# Altium schematic sheet PWR_stage_AC.SchDoc
size 420 x 297 mm; SPICEModelCacheMYOJSQKR: <root> / <DocumentId>MYOJSQKR</DocumentId> / <CacheFrame Number="0"> / <Model Name="860080473007_120uf" Kind="CKT"> / <Text>******* / .subckt 860080473007_120uF 1 2 / Rser 1 3 0.1 / Lser 2 4 0.000000005 / C1 3 4 0.00012 / Rpar 3 4 833333.333333333 / .ends 860080473007_120uF</Text> / </Model> / </CacheFrame> / </root>
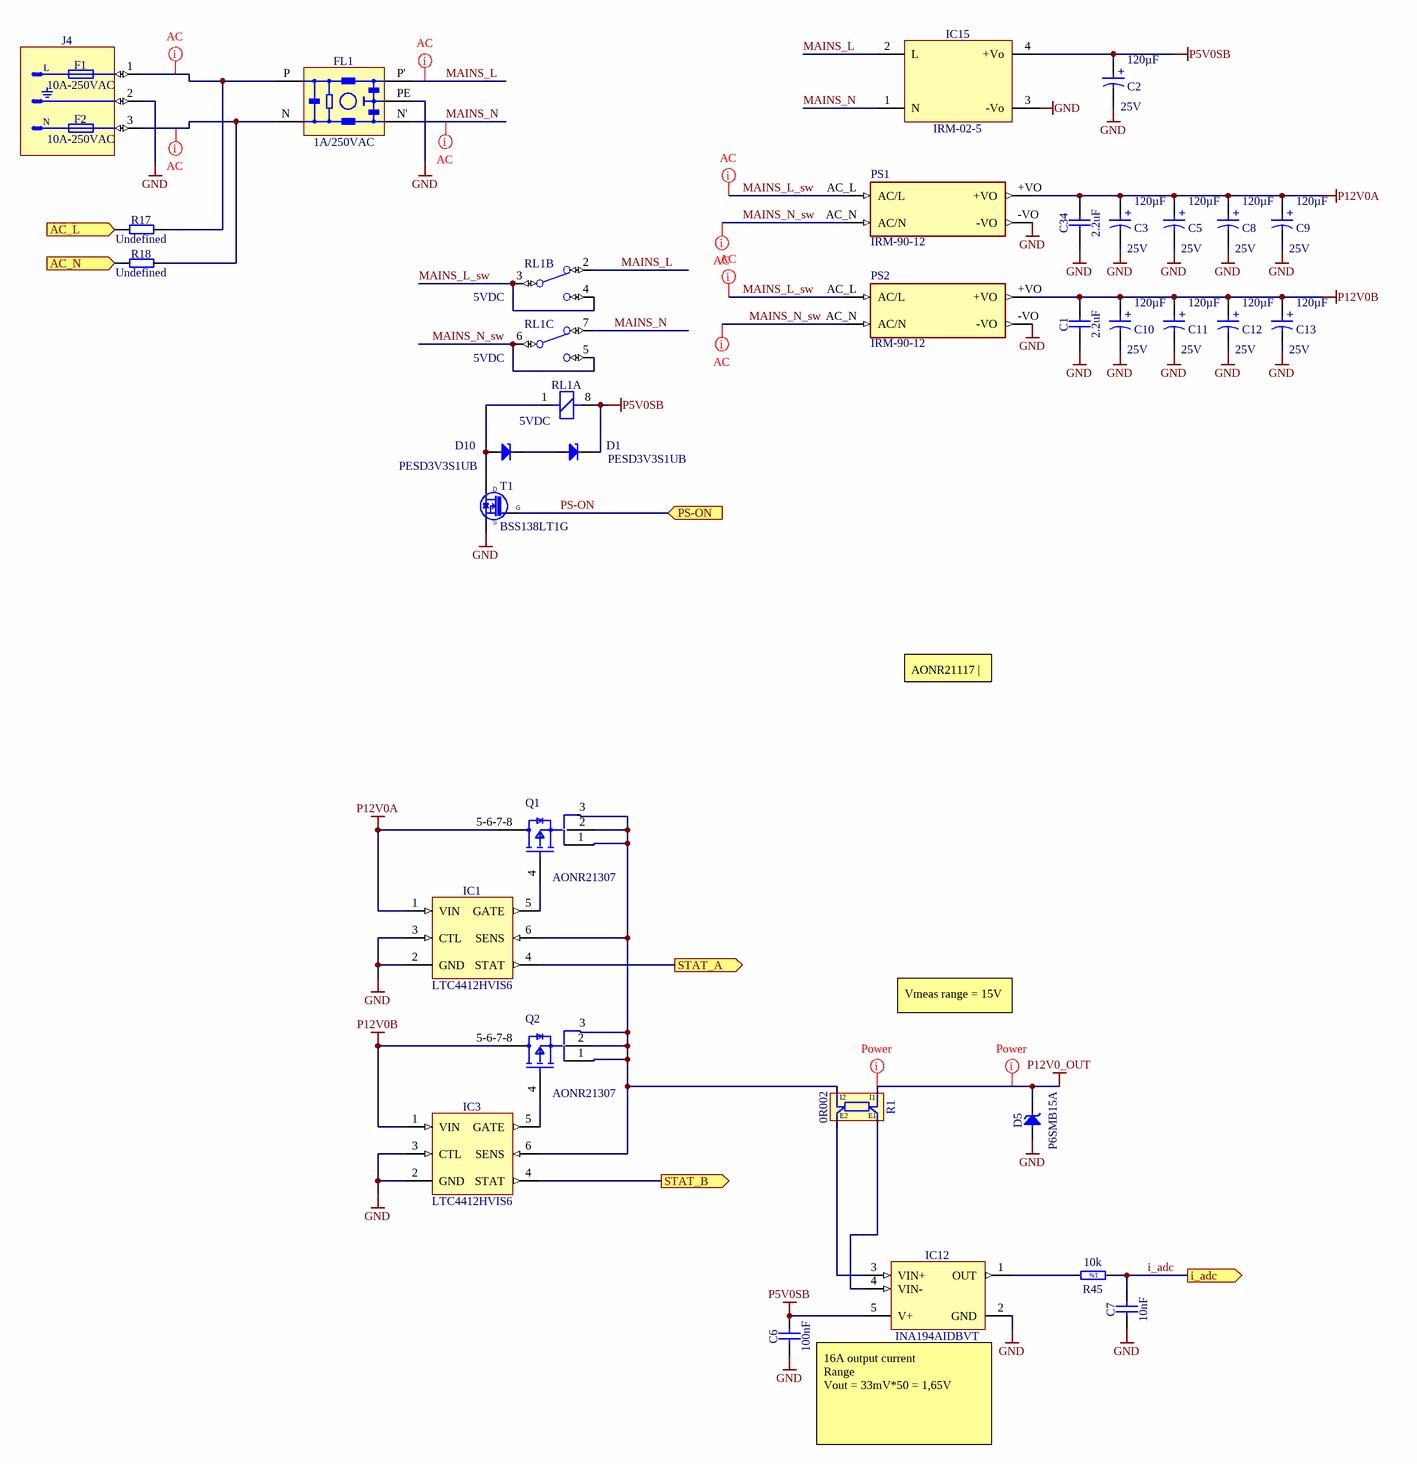
[diagram p0: PWR_stage_AC.SchDoc]

## Parts
C1  2.2uF  [CAPC2013X145N]
C2  Rated Voltage (DC): 25V  [WCAP-ATLI_D6.3H15]  (hidden comment: 120µF)
C3  Rated Voltage (DC): 25V  [WCAP-ATLI_D6.3H15]  (hidden comment: 120µF)
C5  Rated Voltage (DC): 25V  [WCAP-ATLI_D6.3H15]  (hidden comment: 120µF)
C6  100nF  [CAPC1005X55N]
C7  10nF  [CAPC1005X55N]
C8  Rated Voltage (DC): 25V  [WCAP-ATLI_D6.3H15]  (hidden comment: 120µF)
C9  Rated Voltage (DC): 25V  [WCAP-ATLI_D6.3H15]  (hidden comment: 120µF)
C10  Rated Voltage (DC): 25V  [WCAP-ATLI_D6.3H15]  (hidden comment: 120µF)
C11  Rated Voltage (DC): 25V  [WCAP-ATLI_D6.3H15]  (hidden comment: 120µF)
C12  Rated Voltage (DC): 25V  [WCAP-ATLI_D6.3H15]  (hidden comment: 120µF)
C13  Rated Voltage (DC): 25V  [WCAP-ATLI_D6.3H15]  (hidden comment: 120µF)
C34  2.2uF  [CAPC2013X145N]
D1  PESD3V3S1UB  [SODFL1608X65N]
D5  P6SMB15A  [DIOM5436X261N]
D10  PESD3V3S1UB  [SODFL1608X65N]
F1  10A-250VAC  [FUSE_5X20_GLASS_v]
F2  10A-250VAC  [FUSE_5X20_GLASS_v]
FL1  1A/250VAC  [FIL_SCHAFFNER_FN 406]
IC1  LTC4412HVIS6  [SOT95P280X100-6N]
IC3  LTC4412HVIS6  [SOT95P280X100-6N]
IC12  INA194AIDBVT  [SOT95P280X145-5N]
IC15  IRM-02-5  [PWS_MEANWELL_IRM-02]
J4  IEC  [SCHURTER_GSF1.2202.31]  (value not drawn)
PS1  IRM-90-12  [CONV_IRM-90-12]
PS2  IRM-90-12  [CONV_IRM-90-12]
Q1  AONR21307  [FP-DFN3x3A_8L_EP1_P-MFG]
Q2  AONR21307  [FP-DFN3x3A_8L_EP1_P-MFG]
R1  0R002  [RES_VISHAY_WSK2512_0R005-0R2]
R17  Undefined  [RESC6331X70N]
R18  Undefined  [RESC6331X70N]
R45  10k  [RESC1005X40N]
RL1  5VDC  [REL_OMRON_G2RL-2-5DC]  (parts A,B,C of 3)
T1  BSS138LT1G  [SOT95P240X110-3N]

## Ports
AC_L (in), AC_N (in), i_adc (out), PS-ON (in), STAT_A (out), STAT_B (out)

## Nets
GND: C1.1 C2.2(N) C3.2(N) C5.2(N) C6.1 C7.1 C8.2(N) C9.2(N) C10.2(N) C11.2(N) C12.2(N) C13.2(N) C34.1 D5.2(A) FL1.PE IC1.2(GND) IC1.3(CTL) IC3.2(GND) IC3.3(CTL) IC12.2(GND) IC15.3(-Vo) J4.2 PS1.-VO PS2.-VO T1.2(S)
P5V0SB: C2.1(P) C6.2 D1.1(C) IC12.5(V+) IC15.4(+Vo) RL1.8
P12V0_OUT: D5.1(C) R1.I1
P12V0A: C3.1(P) C5.1(P) C8.1(P) C9.1(P) C34.2 IC1.1(VIN) PS1.+VO Q1.5-6-7-8(D)
P12V0B: C1.2 C10.1(P) C11.1(P) C12.1(P) C13.1(P) IC3.1(VIN) PS2.+VO Q2.5-6-7-8(D)
AC_L: R17.1 ; port AC_L
AC_N: R18.1 ; port AC_N
i_adc: C7.2 R45.1 ; port i_adc
MAINS_L: FL1.P' IC15.2(L) RL1.2(NC)
MAINS_L_sw: PS1.AC_L(AC/L) PS2.AC_L(AC/L) RL1.3(C) RL1.4(NO)
MAINS_N: FL1.N' IC15.1(N) RL1.7(NC)
MAINS_N_sw: PS1.AC_N(AC/N) PS2.AC_N(AC/N) RL1.5(NO) RL1.6(C)
PS-ON: T1.1(G) ; port PS-ON
STAT_A: IC1.4(STAT) ; port STAT_A
STAT_B: IC3.4(STAT) ; port STAT_B
NetD1_2: D1.2(A) D10.1(C)
NetD10_2: D10.2(A) RL1.1 T1.3(D)
NetFL1_N: FL1.N J4.3 R18.2
NetFL1_P: FL1.P J4.1 R17.2
NetIC1_5: IC1.5(GATE) Q1.4(G)
NetIC1_6: IC1.6(SENS) IC3.6(SENS) Q1.1(S) Q1.2(S) Q1.3(S) Q2.1(S) Q2.2(S) Q2.3(S) R1.I2
NetIC3_5: IC3.5(GATE) Q2.4(G)
NetIC12_1: IC12.1(OUT) R45.2
NetIC12_3: IC12.3(VIN+) R1.E2
NetIC12_4: IC12.4(VIN-) R1.E1

## Layout directives
net class Power: P12V0_OUT
net class AC: MAINS_L, MAINS_L_sw, MAINS_N, MAINS_N_sw, NetFL1_N, NetFL1_P

## Notes on the sheet
- AONR21117 | Tranzystor: P-MOSFET; unipolarny; 20V; 26,5A; 5W; DFN8
  AONR21117
- Vmeas range = 15V
- 16A output current
  Range
  Vout = 33mV*50 = 1,65V
- Project/Equipment
- Document
- Designer
- Drawn by
- Check.by
- Copyright WUT ISE 2020.
  This documentation describes Open Hardware and is licensed under the CERN OHL v.1.2. You may redistribute and modify this documentation under the terms of the CERN OHL v.1.2. (http://ohwr.org/CERNOHL). This documentation is distributed WITHOUT ANY EXPRESS OR IMPLIED WARRANTY, INCLUDING OF MERCHANTABILITY, SATISFACTORY QUALITY AND FITNESS FOR A PARTICULAR PURPOSE. Please see the CERN OHL v.1.2 for applicable conditions.
- Contact
- File
- Last Mod.
- Print Date
- Sheet
- Size
- A3
- of
- Rev
- (in symbol 860080473007) +
- (in symbol R0402_10K_1%_0.0625W_100PPM) 1%
- (in symbol SCHURTER_GSF1.2202.31) L; N

## Library data of the parts
C1 C34 = CC0805_2.2UF_35V_10%_X7R_TDK_CGA4J1X7R1V225K125AC: Non-polarised capacitor; Part Description: SMD Multilayer Chip Ceramic Capacitor (Automotive Grade); Manufacturer: TDK; Voltage: 35V; TC: X7R; Tolerance: ±10%; Part Number: CC0805_2.2UF_35V_10%_X7R_TDK_CGA4J1X7R1V225K125AC; Component Kind: Standard; Component Type: Standard; Pin Count: 2; Value: 2.2uF; Status: Not Recommended; Manufacturer Part Number: CGA4J1X7R1V225K125; Case: 0805; Mounted: Yes; Socket: No; SMD: Yes; Sense: No; ComponentHeight: 1.45mm; HelpURL: \\cern.ch\dfs\Applications\Altium\Datasheets\CC0805_X7R_TDK_CGA.pdf; Author: CERN DEM BC; CreateDate: 26.02.2016; LatestRevisionDate: 13.09.2016
C2 C3 C5 C8-C13 = 860080473007: WCAP-ATLI Aluminum Electrolytic Capacitor, Radial, THT, D6.3 x H15mm, 120µF, 25V; Manufacturer: Wurth Elektronik; Capacitance Tolerance: +/-20%; Dissipation Factor: 10%; Endurance: 2000h; Leakage Current: 30µA; Ripple Current: 490mA; Technical Reference: ATED150121M025DSPA4B000; Manufacturer Part Number: 860080473007; Category: Aluminum Electrolytic Capacitors; Match Code: WCAP-ATLI; ComponentLink1Description: Website Link; ComponentLink1URL: https://www.we-online.com/redexpert/article/860080473007?ad; ComponentLink2Description: Datasheet Link; ComponentLink2URL: https://www.we-online.com/redexpert/spec/860080473007?ad; Mount: Through Hole; Operating Temperature Max: 105°C; Operating Temperature Min: -55°C; Packaging: Ammo Pack; Height: 15mm; Diameter: 6.3mm; Capacitance: 120µF
C6 = CC0402_100NF_25V_10%_X7R_YUDEN_TMK105B7104KVHF: Non-polarised capacitor; Part Description: SMD Multilayer Chip Ceramic Capacitor (High Dielectric Type) for Automotive / Industrial Applications; Manufacturer: TAIYO YUDEN; Voltage: 25V; TC: X7R; Tolerance: ±10%; Part Number: CC0402_100NF_25V_10%_X7R_YUDEN_TMK105B7104KVHF; Component Kind: Standard; Component Type: Standard; Pin Count: 2; Value: 100nF; Status: Not Recommended; Manufacturer Part Number: TMK105B7104KVHF; Case: 0402; Mounted: Yes; Socket: No; SMD: Yes; Sense: No; HelpURL: \\cern.ch\dfs\Applications\Altium\Datasheets\CC0402_TAIYO-YUDEN_TMK105B7104KVHF.pdf; Author: CERN DEM JLC; CreateDate: 10/05/2017; LatestRevisionDate: 10/05/2017; ComponentHeight: 0.55mm
C7 = CC0402_10NF_50V_10%_X7R: Non-polarised capacitor; Part Description: SMD Multilayer Chip Ceramic Capacitor; Manufacturer: GENERIC; Manufacturer1 Part Number: GRM155R71H103KA88D; Voltage: 50V; TC: X7R; Tolerance: ±10%; Part Number: CC0402_10NF_50V_10%_X7R; Component Kind: Standard; Component Type: Standard; Pin Count: 2; Value: 10nF; Status: None; Manufacturer Part Number: CC0402_10NF_50V_10%_X7R; Case: 0402; Mounted: Yes; Socket: No; SMD: Yes; Sense: No; Manufacturer1 Example: MURATA; Manufacturer1 ComponentHeight: 0.55mm; HelpURL: \\cern.ch\dfs\Applications\Altium\Datasheets\CC0402_X7R_MURATA_GRM.pdf; Author: CERN DEM MR; CreateDate: 08/01/2016; LatestRevisionDate: 08/01/2016
D1 D10 = PESD3V3S1UB: ESD protection diode; Part Description: ESD protection diode (23kV); Manufacturer: NXP SEMICONDUCTORS; Voltage: 3V3; Power: 330W; PressFit: No; Bonding: No; Part Number: PESD3V3S1UB; Component Kind: Standard; Component Type: Standard; Device: PESD3V3S1UB; PackageDescription: Ultra Small Outline Diode Flat Lead (SOD-523), Body; 1.2mm L X 0.8mm W X 0.65mm H, IPC Medium Density; Manufacturer Part Number: PESD3V3S1UB; Pin Count: 2; Case: SOD523; Mounted: Yes; Socket: No; SMD: Yes; Sense: No; ComponentHeight: 0.65mm; HelpURL: \\cern.ch\dfs\Applications\Altium\Datasheets\PESD3V3S1UB.pdf; Author: CERN DEM JLC; CreateDate: 29.11.2012; LatestRevisionDate: 29.11.2012
D5 = P6SMB15A: Transient Voltage Suppressor Diode (Uni-Directional); Part Description: Uni-directional Transient Voltage Suppressor (TVS) Diode; Manufacturer: LITTELFUSE; Voltage: 15V; Power: 600W; PressFit: No; Bonding: No; Part Number: P6SMB15A; Component Kind: Standard; Component Type: Standard; Device: P6SMB15A; PackageDescription: DO-214-AA/SMB Diode, Molded Body; 5.40mm L X 3.62mm W X 2.61mm H, IPC Medium Density; Manufacturer Part Number: P6SMB15A; Pin Count: 2; Case: SMB; Mounted: Yes; Socket: No; SMD: Yes; Sense: No; ComponentHeight: 2.61mm; HelpURL: \\cern.ch\dfs\Applications\Altium\Datasheets\P6SMB15A.pdf; Author: CERN DEM JLC; CreateDate: 12.07.2017; LatestRevisionDate: 12.07.2017
F1 F2 = FUSE_SCHURTER_0034.3127_v: Fuse; Part Description: Cylindrical 5x20 mm, Time-Lag T Miniature Fuse, FST Series; PressFit: No; Part Number: FUSE_SCHURTER_0034.3127_v; Component Kind: Accessories; Component Type: Standard; Pin Count: 0; PackageDescription: 5x20mm Cylindrical Fuse, SCHURTER FST5X20 Series; Family: Fuse; Mounted: Yes; Socket: Yes; SMD: No; Sense: No; Value: 10A-250VAC; Manufacturer: SCHURTER; Manufacturer Part Number: 0034.3127; ComponentHeight: 20.5mm; HelpURL: \\cern.ch\dfs\Applications\Altium\Datasheets\FUSE_SCHURTER_FST5X20.pdf; Author: CERN DEM JLC; CreateDate: 28.01.2013; LatestRevisionDate: 28.01.2013
FL1 = FIL_SCHAFFNER_FN 406-1-02: 0.6 to 8.4A 230VAC Single Phase Ultra Compact EMC Filter; Part Number: FIL_SCHAFFNER_FN406-3-02; Manufacturer Part Number: FN406-3-02; Component Kind: Standard; Component Type: Standard; Pin Count: 5; Value: 1A/250VAC; Part Description: Single Phase Ultra Compact EMC Filter; Manufacturer: SCHAFFNER; Case: L45 W15 H28; Mounted: Yes; Socket: No; SMD: No; Sense: No; ComponentHeight: 28mm; HelpURL: \\cern.ch\dfs\Applications\Altium\Datasheets\FIL_SCHAFFNER_FN 406-1-02.pdf; Author: CERN DEM JLC; CreateDate: 24.05.2017; LatestRevisionDate: 24.05.2017
IC1 IC3 = LTC4412HVIS6#PBF: 36V, Low Loss PowerPathTM Controller in ThinSOT; Part Description: 36V, Low Loss PowerPath Controller in ThinSOT; Manufacturer: LINEAR TECHNOLOGY; PressFit: No; Bonding: No; Part Number: LTC4412HVIS6#PBF; Component Kind: Standard; Component Type: Standard; Device: LTC4412HVIS6; PackageDescription: SOT, 0.95mm Pitch; 6 Pin, 1.625mm W X 2.90mm L X 1.00mm H body, IPC Medium Density; Manufacturer Part Number: LTC4412HVIS6; Pin Count: 6; Case: SOT23-6; Mounted: Yes; Socket: No; SMD: Yes; Sense: No; ComponentHeight: 1mm; Author: CERN DEM JLC; HelpURL: \\cern.ch\dfs\Applications\Altium\Datasheets\LTC4412HVIS6#PBF.pdf; CreateDate: 22.03.2018; LatestRevisionDate: 02.02.2022
IC12 = INA194AIDBVT: Current Shunt Monitor -16V to +80V Common-Mode Range; Manufacturer: TEXAS INSTRUMENTS; PressFit: No; Bonding: No; Part Number: INA194AIDBVT; Component Kind: Standard; Component Type: Standard; Device: INA194AIDBVT; PackageDescription: SOT, 0.95mm pitch; 5 pin, 1.60mm W X 2.90mm L X 1.45mm H body, IPC Medium Density; Part Description: Current Shunt Monitor -16V to +80V Common-Mode Range; Manufacturer Part Number: INA194AIDBVT; Pin Count: 5; Case: SOT23-5; Mounted: Yes; Socket: No; SMD: Yes; Sense: No; ComponentHeight: 1.45mm; Author: CERN DEM JLC; HelpURL: \\cern.ch\dfs\Applications\Altium\Datasheets\INA194AIDBVT.pdf; CreateDate: 10.05.2010; LatestRevisionDate: 10.05.2010
IC15 = AC_DC_IRM-02-5: Power Supply; Part Description: 85-305VAC to 5VDC (400mA) 2W Power Supply; Manufacturer: MEAN WELL; PressFit: No; Bonding: No; Part Number: IRM-02-5; Component Kind: Standard; Component Type: Standard; Device: IRM-02-5; PackageDescription: IRM-02 Series, Body 33.7x22.2mm, Power Supply; Status: None; Manufacturer Part Number: IRM-02-5; Pin Count: 4; Mounted: Yes; Socket: No; SMD: No; Sense: No; ComponentHeight: 15mm; HelpURL: \\cern.ch\dfs\Applications\Altium\Datasheets\IRM-02-24.pdf; Author: GK; CreateDate: 14.02.2018; LatestRevisionDate: 14.02.2018
J4 = SCHURTER_GSF1.2202.31: Connector 3 Male 2P+ 2 Fuse Holder; Part Number: SCHURTER_GSF1.2201.31; Part Description: 10A 250Vac Sandwich Panel Mount (1.5mm) Inlet IEC Connector With 2 Fuseholder 5x20mm And Snap-in PCB Mount; Manufacturer Part Number: GSF1.2201.31; PressFit: No; Component Kind: Standard; Component Type: Standard; Footprint: SCHURTER_GSF1.2201.31; Pin Count: 3; Family: IEC; Mounted: Yes; Socket: No; SMD: No; Sense: No; Status: None; Manufacturer: SCHURTER; ComponentHeight: 24.45mm; HelpURL: \\cern.ch\dfs\Applications\Altium\Datasheets\SCHURTER_GSF1.2202.31.pdf; Author: CERN DEM JMW; CreateDate: 20.09.2012; LatestRevisionDate: 20.09.2012
PS1 PS2 = AC_DC_IRM-90-12: MF: {'manufacturer': u'MEAN WELL USA Inc.'}; Package: None; Price: None; Value: *; MP: IRM-90-12; Availability: Unavailable
Q1 Q2 = CMP-83955-000002-1: MOSFET P-CH 30V 3X3 DFN; Manufacturer: Alpha & Omega Semiconductor; Reverse Recovery Time: 13.3ns; Reverse Recovery Charge: 20nC; Turn Off Delay Time: 43.5ns; Max Forward Diode Voltage: -1V; Gate Charge At Vgs: 35nC @ -10V; Threshold Vgs Min: -1.3V; Gate To Source Voltage: 25V; Turn On Delay Time: 11ns; Continuous Drain Current: -24A; Power Dissipation: 5W; Max Junction Temp: +150°C; Number Of P Channels: 1; Drain To Source Voltage: -30V; Standoff Height: 0mm; Input Capacitace At Vds: 1995pF @ -15V; Depletion Mode: False; Threshold Vgs Max: -2.3V; Rthja Max: 45°C/W; Drain To Source Resistance: 9.2mΩ; Pulse Drain Current: -82A; Typ Forward Diode Voltage: -0.7V; Temperature Range Low: -55°C; Device Class L1: Discrete Semiconductors; Footprint Url: http://www.aosmd.com/res/packaging_information/DFN3x3A_8L_EP1_P.pdf; ComponentLink2Description: Datasheet; Device Class L2: Transistors; ComponentLink2URL: http://www.aosmd.com/res/data_sheets/AONR21307.pdf; Automotive: No; Temperature: -55°C to +150°C; Octopart: https://octopart.com/aonr21307-alpha+%26+omega+semiconductor-96014004; RoHS: TRUE; Digikey Description: MOSFET P-CH 30V 3X3 DFN; Drain To Source Breakdown Voltage: -30V; Package: DFN3x3A_8L_EP1_P; Manufacturer Part Number: AONR21307; Category: Trans; Height: 0.9mm; Lead Free: Yes; Device Class L3: MOSFETs; Temperature Range High: +150°C; Number Of Channels: 1
R1 = R2512_0R002_1%_1W_35PPM_VISHAY_WSK: Power and Current Sensing Resistor; Part Description: Power Metal Strip® Resistor, Low Value; Manufacturer: VISHAY DALE; Manufacturer Part Number: WSK25122L000FEA; Power: 1W; TC: ±35ppm/°C; Tolerance: ±1%; PressFit: No; Part Number: R2512_0R002_1%_1W_35PPM_VISHAY_WSK; Component Kind: Standard; Component Type: Standard; Pin Count: 4; Value: 0R002; Status: None; Case: 2512; Mounted: Yes; Sense: No; Socket: No; SMD: Yes; ComponentHeight: 0.89mm; HelpURL: \\cern.ch\dfs\Applications\Altium\Datasheets\R2512_VISHAY_WSK.pdf; Author: CERN DEM MR; CreateDate: 08.11.2016; LatestRevisionDate: 19.02.2018
R17 R18 = R2512_NO-VALUE: Resistor; Part Description: Reserved Footprint For a 2512 (6332) Chip Resistor; PressFit: No; Mounted: No; Part Number: R2512_NO-VALUE; Component Kind: Standard; Component Type: Standard; Pin Count: 2; Value: Undefined; Status: None; Manufacturer: Undefined; Manufacturer Part Number: R2512_NO-VALUE; Case: 2512; Sense: No; Socket: No; SMD: Yes; Manufacturer1 Example: Undefined; Manufacturer1 Part Number: Undefined; Manufacturer1 ComponentHeight: Undefined; HelpURL: Undefined; Author: CERN DEM JLC; CreateDate: 01.04.2014; LatestRevisionDate: 01.04.2014
R45 = R0402_10K_1%_0.0625W_100PPM: Resistor - 1%; Part Description: General Purpose Thick Film Chip Resistor; Manufacturer: GENERIC; Manufacturer1 Part Number: 232270671003L; TC: ±100ppm/°C; PressFit: No; Part Number: R0402_10K_1%_0.0625W_100PPM; Component Kind: Standard; Component Type: Standard; Pin Count: 2; Value: 10k; Status: Not Recommended; Power: 0.0625W; Tolerance: ±1%; Manufacturer Part Number: R0402_10K_1%_0.0625W_100PPM; Case: 0402; Mounted: Yes; Sense: No; Socket: No; SMD: Yes; Manufacturer1 Example: YAGEO PHYCOMP; Manufacturer1 ComponentHeight: 0.4mm; HelpURL: \\cern.ch\dfs\Applications\Altium\Datasheets\R0402_Phycomp_RC0402.pdf; Author: CERN DEM JLC; CreateDate: 03/12/2007; LatestRevisionDate: 17/10/2012
RL1 = REL_OMRON_G2RL-24: DPDT Power Relay, G2RL Series; Manufacturer: OMRON ELECTRONIC; Manufacturer Part Number: G2RL-2-5DC; PressFit: No; Part Number: REL_OMRON_G2RL-2-5DC; Component Kind: Standard; Component Type: Standard; Pin Count: 8; PackageDescription: 8 Leads, Row Spacing 7.5mm; Body 29mm x 12.7mm, OMRON_G2RL Series; Mounted: Yes; Socket: No; SMD: No; Sense: No; Status: None; Value: 5VDC; Part Description: DPDT Power Relay, G2RL Series; ComponentHeight: 15.7mm; HelpURL: \\cern.ch\dfs\Applications\Altium\Datasheets\REL_OMRON_G2RL-24.pdf; Author: GK; CreateDate: 16.06.2015; LatestRevisionDate: 16.06.2015
T1 = BSS138LT1G: N-CHANNEL MOSFET WITH DIODE; Part Description: 50V 200mA N-Channel Enhancement Mode Field-Effect Transistor; Manufacturer: ON SEMICONDUCTOR; PressFit: No; Bonding: No; Part Number: BSS138LT1G; Component Kind: Standard; Component Type: Standard; Device: BSS138LT1G; PackageDescription: SOT23 3-Leads, Pitch 0.95mm - Body 1.4x3mm, IPC Medium Density; Manufacturer Part Number: BSS138LT1G; Pin Count: 3; Case: SOT23-3; Mounted: Yes; Socket: No; SMD: Yes; Sense: No; ComponentHeight: 1.11mm; HelpURL: \\cern.ch\dfs\Applications\Altium\Datasheets\BSS138LT1G.pdf; Author: CERN DEM JLC; CreateDate: 23.03.2009; LatestRevisionDate: 23.03.2009